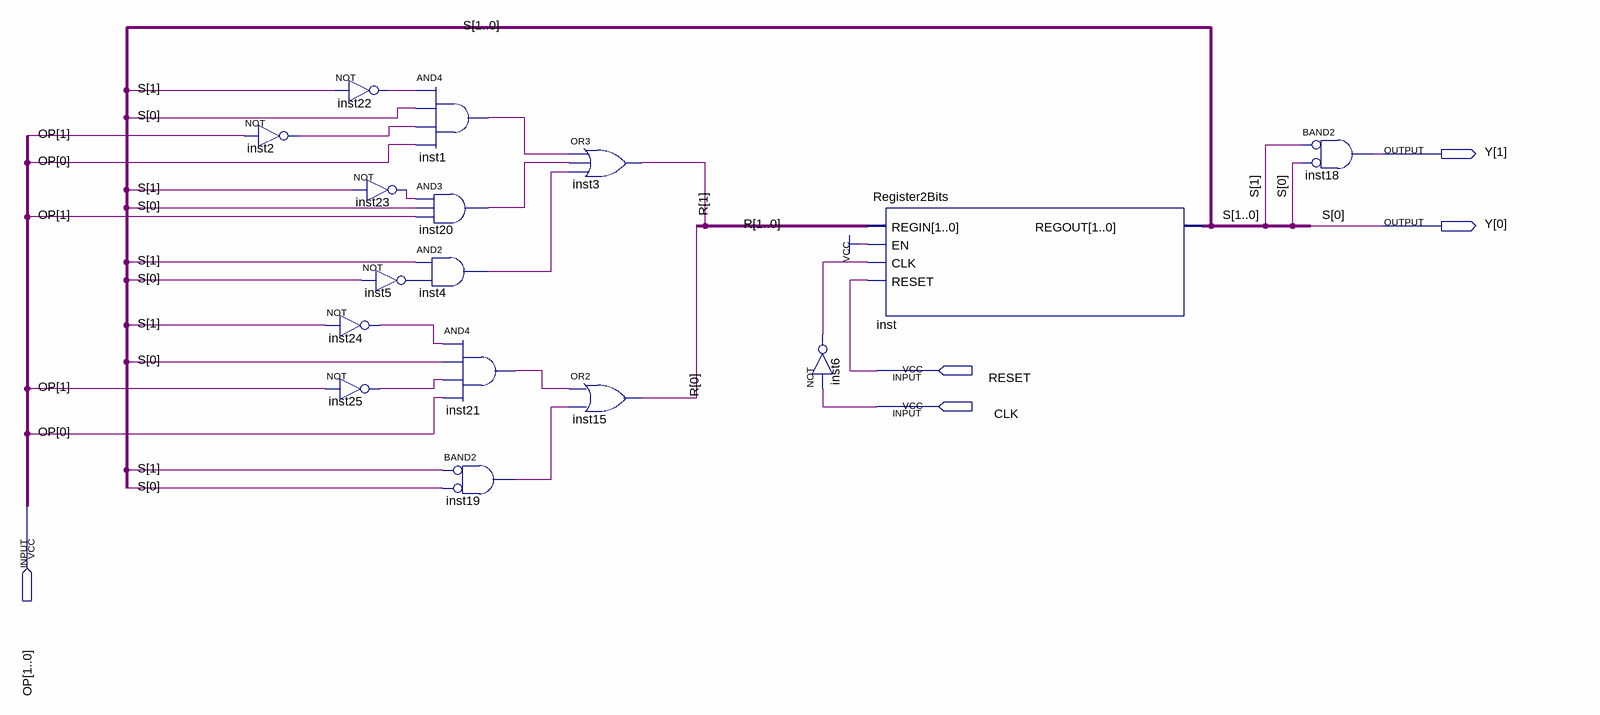
[diagram p0: schematic sheet]
// Quartus schematic CentralControl.bdf as structural Verilog: 16 symbols, 5 pins
module CentralControl (
  input  RESET,
  input  CLK,
  input  [1:0] OP,
  output [1:0] Y
);

  wire inst1_out, inst2_out, inst4_out, inst5_out, inst6_out, inst19_out, inst20_out, inst21_out, inst22_out,
       inst23_out, inst24_out, inst25_out;
  wire [1:0] R;
  wire [1:1] S;

  not inst2 (inst2_out, OP[1]);
  not inst22 (inst22_out, S[1]);
  not inst23 (inst23_out, S[1]);
  not inst5 (inst5_out, Y[0]);
  not inst24 (inst24_out, S[1]);
  not inst25 (inst25_out, OP[1]);
  and inst1 (inst1_out, inst22_out, Y[0], inst2_out, OP[0]);
  and inst20 (inst20_out, inst23_out, Y[0], OP[1]);
  and inst4 (inst4_out, S[1], inst5_out);
  and inst21 (inst21_out, inst24_out, Y[0], inst25_out, OP[0]);
  and inst19 (inst19_out, ~S[1], ~Y[0]);  // BAND2
  or inst3 (R[1], inst1_out, inst20_out, inst4_out);
  or inst15 (R[0], inst21_out, inst19_out);
  Register2Bits inst (.REGIN(R), .EN(1'b1), .CLK(inst6_out), .RESET(RESET), .REGOUT({S[1], Y[0]}));
  not inst6 (inst6_out, CLK);
  and inst18 (Y[1], ~S[1], ~Y[0]);  // BAND2

  // Other names for the same wires on the sheet: S[0] = Y[0]
endmodule
